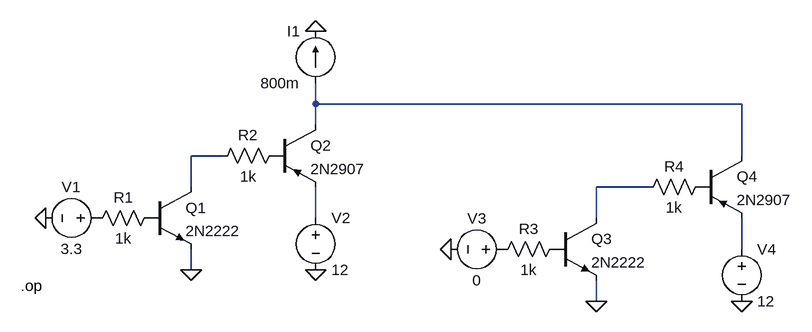
[diagram p0: schematic high_side_driver_simulation.asc]
high_side_driver_simulation.asc, the LTspice schematic file:
Version 4
SHEET 1 1140 680
WIRE 368 -64 368 -96
WIRE 1024 -64 368 -64
WIRE 368 -32 368 -64
WIRE 224 16 176 16
WIRE 1024 16 1024 -64
WIRE 176 64 176 16
WIRE 880 64 800 64
WIRE 368 112 368 64
WIRE 800 112 800 64
WIRE 1024 160 1024 112
WIRE 176 192 176 160
WIRE 800 240 800 208
FLAG 176 192 0
FLAG -48 112 0
FLAG 368 192 0
FLAG 368 -176 0
FLAG 800 240 0
FLAG 576 160 0
FLAG 1024 240 0
SYMBOL npn 112 64 R0
SYMATTR InstName Q1
SYMATTR Value 2N2222
SYMBOL pnp 304 -32 R0
SYMATTR InstName Q2
SYMATTR Value 2N2907
SYMBOL res 128 96 R90
WINDOW 0 0 56 VBottom 2
WINDOW 3 32 56 VTop 2
SYMATTR InstName R1
SYMATTR Value 1k
SYMBOL voltage 48 112 R90
WINDOW 0 -32 56 VBottom 2
WINDOW 3 32 56 VTop 2
WINDOW 123 0 0 Left 0
WINDOW 39 0 0 Left 0
SYMATTR InstName V1
SYMATTR Value 3.3
SYMBOL voltage 368 96 R0
WINDOW 123 0 0 Left 0
WINDOW 39 0 0 Left 0
SYMATTR InstName V2
SYMATTR Value 12
SYMBOL current 368 -96 R180
WINDOW 0 24 80 Left 2
WINDOW 3 24 0 Left 2
WINDOW 123 0 0 Left 0
WINDOW 39 0 0 Left 0
SYMATTR InstName I1
SYMATTR Value 800m
SYMBOL npn 736 112 R0
SYMATTR InstName Q3
SYMATTR Value 2N2222
SYMBOL pnp 960 16 R0
SYMATTR InstName Q4
SYMATTR Value 2N2907
SYMBOL res 752 144 R90
WINDOW 0 0 56 VBottom 2
WINDOW 3 32 56 VTop 2
SYMATTR InstName R3
SYMATTR Value 1k
SYMBOL voltage 672 160 R90
WINDOW 0 -32 56 VBottom 2
WINDOW 3 32 56 VTop 2
WINDOW 123 0 0 Left 0
WINDOW 39 0 0 Left 0
SYMATTR InstName V3
SYMATTR Value 0
SYMBOL voltage 1024 144 R0
WINDOW 123 0 0 Left 0
WINDOW 39 0 0 Left 0
SYMATTR InstName V4
SYMATTR Value 12
SYMBOL res 320 0 R90
WINDOW 0 0 56 VBottom 2
WINDOW 3 32 56 VTop 2
SYMATTR InstName R2
SYMATTR Value 1k
SYMBOL res 976 48 R90
WINDOW 0 0 56 VBottom 2
WINDOW 3 32 56 VTop 2
SYMATTR InstName R4
SYMATTR Value 1k
TEXT -86 216 Left 2 !.op

The netlist it stands for:
* high_side_driver_simulation.asc
Q1 N002 P001 0 0 2N2222
Q2 N001 P002 N004 0 2N2907
R1 P001 P003 1k
V1 P003 0 3.3
V2 N004 0 12
I1 N001 0 800m
Q3 N003 P004 0 0 2N2222
Q4 N001 P005 N005 0 2N2907
R3 P004 P006 1k
V3 P006 0 0
V4 N005 0 12
R2 P002 N002 1k
R4 P005 N003 1k
.model NPN NPN
.model PNP PNP
.lib standard.bjt
.op
.backanno
.end